# Altium schematic sheet LED Driver and Switch Breakout.SchDoc
size A4; SheetNumber: 1; SheetTotal: 5
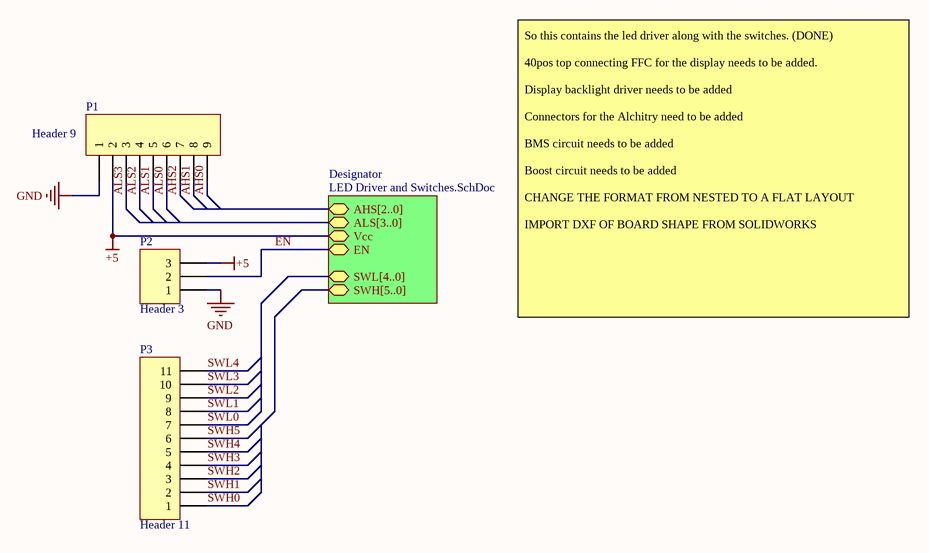
[diagram p0: LED Driver and Switch Breakout.SchDoc]

## Parts
P1  Header 9  [HDR1X9]
P2  Header 3  [HDR1X3]
P3  Header 11  [HDR1X11]

## Sub-sheets
Designator = LED Driver and Switches.SchDoc: AHS[2..0] (bidir), ALS[3..0] (bidir), Vcc (bidir), EN (bidir), SWL[4..0] (bidir), SWH[5..0] (bidir)

## Nets
+5: P1.2 P2.3 ; sheet Designator/Vcc
GND: P1.1 P2.1
AHS0: P1.9
AHS1: P1.8
AHS2: P1.7
ALS0: P1.6
ALS1: P1.5
ALS2: P1.4
ALS3: P1.3
EN: P2.2 ; sheet Designator/EN
SWH0: P3.1
SWH1: P3.2
SWH2: P3.3
SWH3: P3.4
SWH4: P3.5
SWH5: P3.6
SWL0: P3.7
SWL1: P3.8
SWL2: P3.9
SWL3: P3.10
SWL4: P3.11

## Notes on the sheet
- So this contains the led driver along with the switches. (DONE)
  40pos top connecting FFC for the display needs to be added.
  Display backlight driver needs to be added
  Connectors for the Alchitry need to be added
  BMS circuit needs to be added
  Boost circuit needs to be added
  CHANGE THE FORMAT FROM NESTED TO A FLAT LAYOUT
  IMPORT DXF OF BOARD SHAPE FROM SOLIDWORKS

## Library data of the parts
P1 = Header 9: Header, 9-Pin; LatestRevisionDate: 17-Jul-2002; LatestRevisionNote: Re-released for DXP Platform.; Publisher: Altium Limited
P2 = Header 3: Header, 3-Pin; LatestRevisionDate: 17-Jul-2002; LatestRevisionNote: Re-released for DXP Platform.; Publisher: Altium Limited
P3 = Header 11: Header, 11-Pin; LatestRevisionDate: 17-Jul-2002; LatestRevisionNote: Re-released for DXP Platform.; Publisher: Altium Limited